# EAGLE design MyRollerShutter_nrf_1-3a (EAGLE 6.5.0)
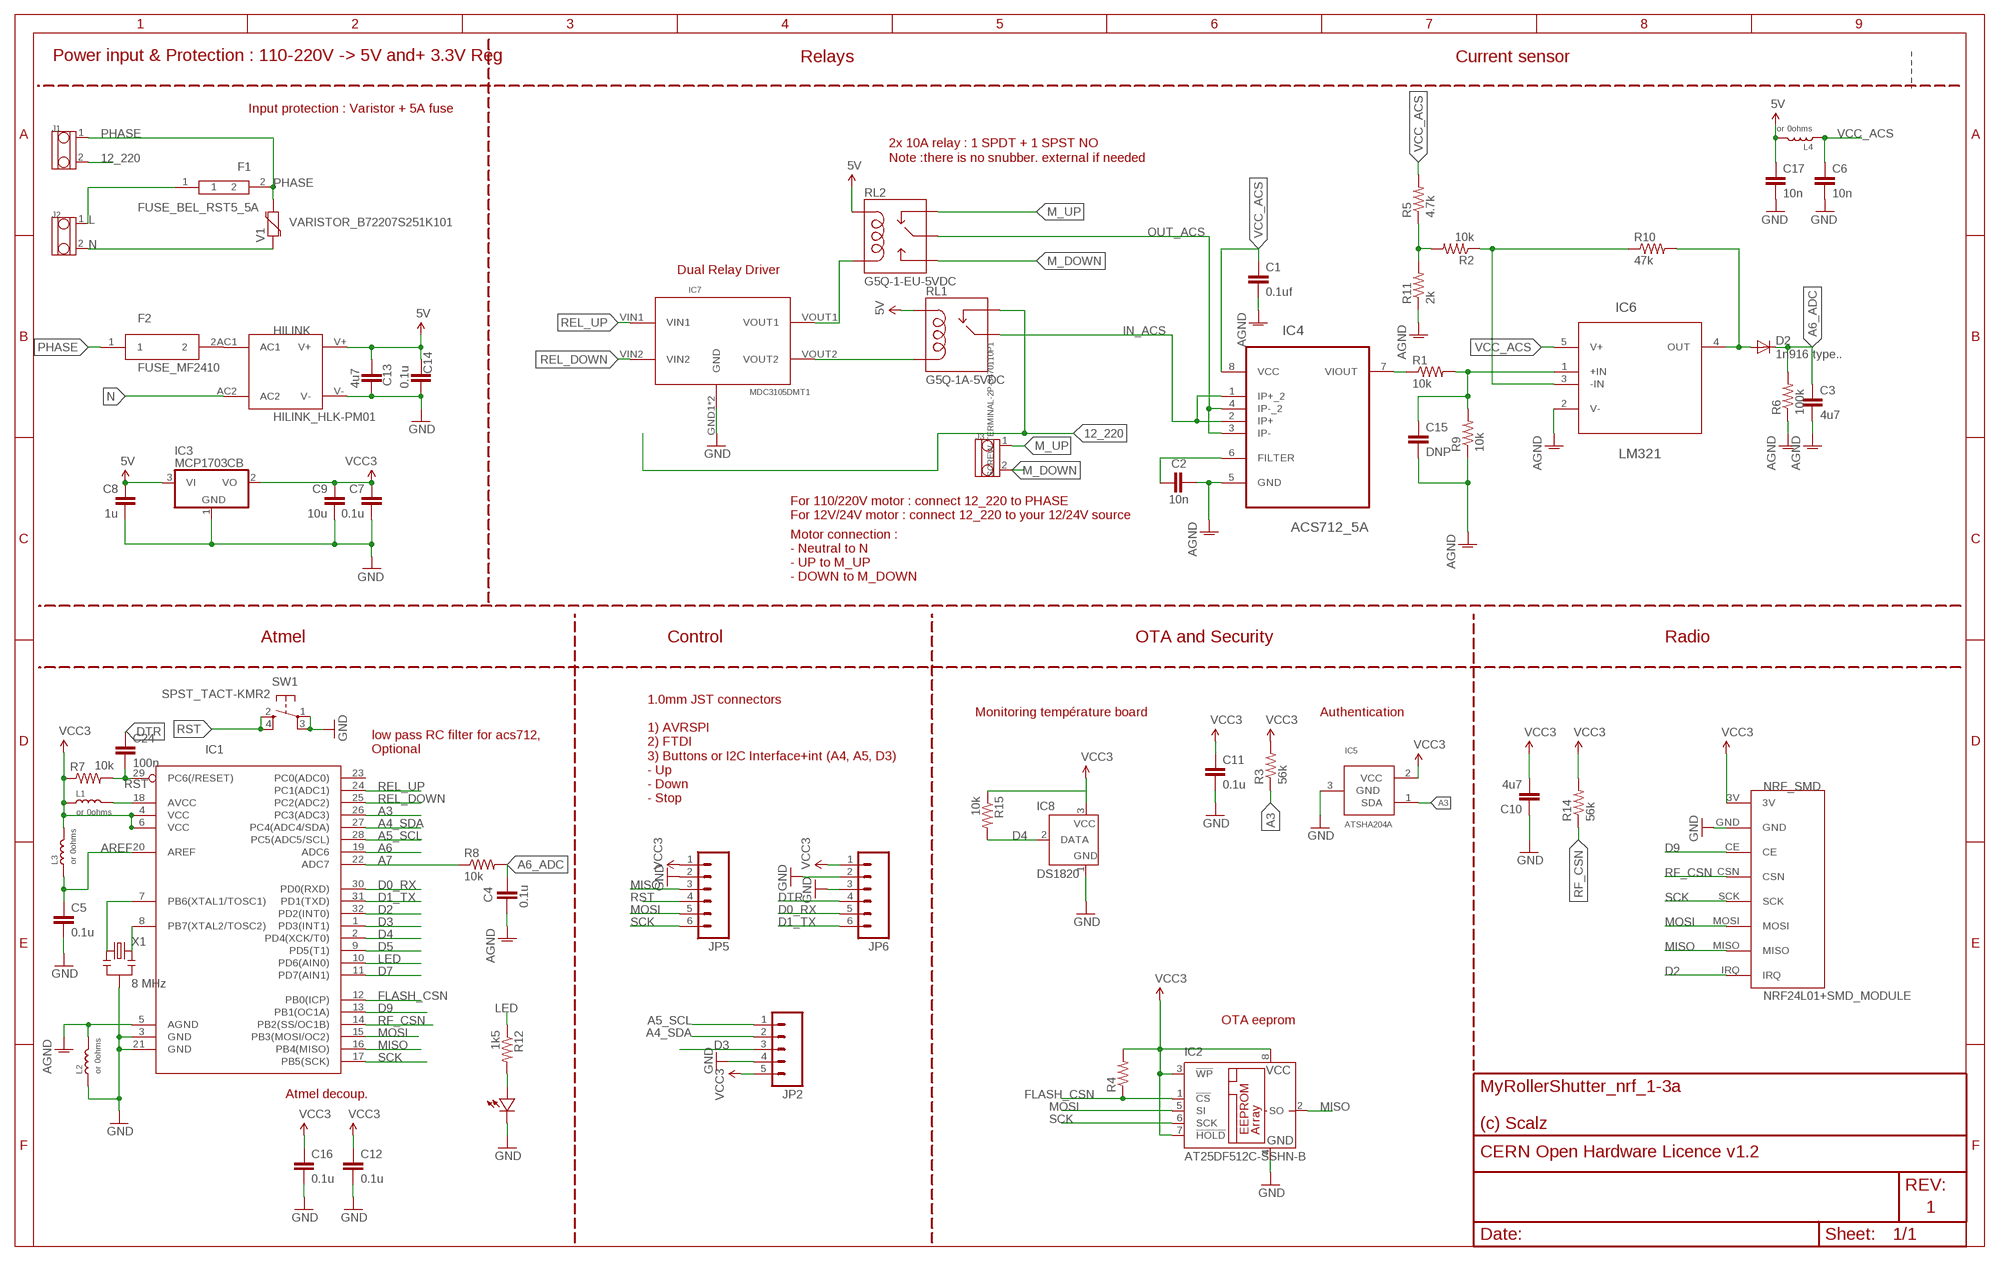
[diagram p0: schematic, sheet 1]

## Parts
C1  0.1uf  CAP0805-CAP  [0805-CAP]
C2  10n  CAP0805-CAP  [0805-CAP]
C3  4u7  CAP0805-CAP  [0805-CAP]
C4  0.1u  CAP0805-CAP  [0805-CAP]
C5  0.1u  CAP0805-CAP  [0805-CAP]
C6  10n  CAP0805-CAP  [0805-CAP]
C7  0.1u  CAP0805-CAP  [0805-CAP]
C8  1u  CAP0805-CAP  [0805-CAP]
C9  10u  CAP0805-CAP  [0805-CAP]
C10  4u7  CAP0805-CAP  [0805-CAP]
C11  0.1u  CAP0805-CAP  [0805-CAP]
C12  0.1u  CAP0805-CAP  [0805-CAP]
C13  4u7  CAP0805-CAP  [0805-CAP]
C14  0.1u  CAP0805-CAP  [0805-CAP]
C15  DNP  CAP0805-CAP  [0805-CAP]
C16  0.1u  CAP0805-CAP  [0805-CAP]
C17  10n  CAP0805-CAP  [0805-CAP]
C24  100n  CAP0805-CAP  [0805-CAP]
D1  LED0805  [0805-LED]
D2  1n916 type..  DIODESOD  [SOD-323]
F1  FUSE_BEL_RST5_5A  [FUSE_BEL_RST5_5A]
F2  FUSE_MF2410  [2410]
HILINK  HILINK_HLK-PM01  [HILINK_HLK-PM01]
IC1  ATMega-328  ATMEGA168/328TQFP32  [TQFP32-08]
IC2  AT25DF512C-SSHN-B  25AA080SN  [SO-08]
IC3  MCP1703CB  [SOT23]
IC4  ACS712_5A  ACS712ELCTR-20A-T  [SOIC127P600X175-8N]
IC5  ATSHA204A  [SOT23]
IC6  LM321  LM321MF  [SOT95P285X120-5N]
IC7  MDC3105DMT1  [MDC3105DMT1]
IC8  DS1820  [TO92-]
J1  SCREW-TERMINAL-2P-3470110P1  [2P-5.0]
J2  SCREW-TERMINAL-2P-3470110P1  [2P-5.0]
J3  SCREW-TERMINAL-2P-3470110P1  [2P-5.0]
JP2  M05SMD  [1X05-1MM]
JP5  M06SMD-1MM  [1X06-1MM]
JP6  M06SMD-1MM  [1X06-1MM]
L1  or 0ohms  INDUCTOR/FERRITE-BEAD-0805  [L0805]
L2  or 0ohms  INDUCTOR/FERRITE-BEAD-0805  [L0805]
L3  or 0ohms  INDUCTOR/FERRITE-BEAD-0805  [L0805]
L4  or 0ohms  INDUCTOR/FERRITE-BEAD-0805  [L0805]
NRF_SMD  NRF24L01+SMD_MODULE  [NRF24L01+SMD_MODULE]
R1  10k  RESISTOR0805-RES  [0805-RES]
R2  10k  RESISTOR0805-RES  [0805-RES]
R3  56k  RESISTOR0805-RES  [0805-RES]
R4  RESISTOR0805-RES  [0805-RES]
R5  4.7k  RESISTOR0805-RES  [0805-RES]
R6  100k  RESISTOR0805-RES  [0805-RES]
R7  10k  RESISTOR0805-RES  [0805-RES]
R8  10k  RESISTOR0805-RES  [0805-RES]
R9  10k  RESISTOR0805-RES  [0805-RES]
R10  47k  RESISTOR0805-RES  [0805-RES]
R11  2k  RESISTOR0805-RES  [0805-RES]
R12  1k5  RESISTOR0805-RES  [0805-RES]
R14  56k  RESISTOR0805-RES  [0805-RES]
R15  10k  RESISTOR0805-RES  [0805-RES]
RL1  G5Q-1A-5VDC  G5Q_SINGLE  [G5Q_SINGLE]
RL2  G5Q-1-EU-5VDC  RELAYPTH  [RELAY-G5Q]
SW1  SPST_TACT-KMR2  [KMR2]
V1  VARISTOR_B72207S251K101  [VARISTOR_B72207S251K101]
X1  8 MHz  RESONATORSMD  [RESONATOR-SMD]

## Nets
5V: C8.1 C13.1 C14.1 C17.1 HILINK.V+ IC3.3(VI) L4.2 RL1.1(COIL1) RL2.5(COIL1)
12_220: J1.2 RL1.3(NC)
A3: IC1.26(PC3(ADC3)) IC5.1(SDA) R3.1
A4_SDA: IC1.27(PC4(ADC4/SDA)) JP2.2
A5_SCL: IC1.28(PC5(ADC5/SCL)) JP2.1
A6: IC1.19(ADC6)
A6_ADC: C3.1 C4.2 D2.1(C) R6.2 R8.2
A7: IC1.22(ADC7) R8.1
AGND: C1.2 C2.2 C3.2 C4.1 C15.2 IC1.5(AGND) IC4.5(GND) IC6.2(V-) L2.2 R6.1 R9.1 R11.1
AREF: C5.1 IC1.20(AREF) L3.1
D0_RX: IC1.30(PD0(RXD)) JP6.5
D1_TX: IC1.31(PD1(TXD)) JP6.6
D2: IC1.32(PD2(INT0)) NRF_SMD.IRQ
D3: IC1.1(PD3(INT1)) JP2.3
D4: IC1.2(PD4(XCK/T0)) IC8.2(DATA) R15.2
D5: IC1.9(PD5(T1))
D7: IC1.11(PD7(AIN1))
D9: IC1.13(PB1(OC1A)) NRF_SMD.CE
DTR: C24.1 JP6.4
FLASH_CSN: IC1.12(PB0(ICP)) IC2.1(!CS) R4.1
GND: C5.2 C6.2 C7.2 C8.2 C9.2 C10.1 C11.2 C12.2 C13.2 C14.2 C16.2 C17.2 D1.MINUS HILINK.V- IC1.3(GND) IC1.21(GND) IC2.4(GND) IC3.1(GND) IC5.3(GND) IC7.GND1(GND) IC7.GND2(GND) IC8.1(GND) JP2.4 JP5.2 JP6.2 JP6.3 L2.1 NRF_SMD.GND SW1.1(P) SW1.3(P1) X1.2
IN_ACS: IC4.1(IP+_2) IC4.2(IP+) RL1.2(MAIN)
L: F1.1 J2.1
LED: IC1.10(PD6(AIN0)) R12.1
LM_OUT: D2.2(A) IC6.4(OUT) R10.2
M_DOWN: J3.2 RL2.3(NO)
M_UP: J3.1 RL2.4(NC)
MISO: IC1.16(PB4(MISO)) IC2.2(SO) JP5.3 NRF_SMD.MISO
MOSI: IC1.15(PB3(MOSI/OC2)) IC2.5(SI) JP5.5 NRF_SMD.MOSI
N: HILINK.AC2 J2.2 V1.1
N$1: C2.1 IC4.6(FILTER)
N$3: IC4.7(VIOUT) R1.1
N$4: IC1.18(AVCC) L1.2
N$6: IC7.VOUT2 RL1.5(COIL2)
N$9: F2.2 HILINK.AC1
N$10: C15.1 IC6.1(+IN) R1.2 R9.2
N$11: IC6.3(-IN) R2.1 R10.1
N$12: IC1.7(PB6(XTAL1/TOSC1)) X1.1
N$17: D1.PLUS R12.2
N$18: R2.2 R5.1 R11.2
N$19: IC7.VOUT1 RL2.1(COIL2)
N$21: IC1.8(PB7(XTAL2/TOSC2)) X1.3
OUT_ACS: IC4.3(IP-) IC4.4(IP-_2) RL2.2(MAIN)
PHASE: F1.2 F2.1 J1.1 V1.2
REL_DOWN: IC1.25(PC2(ADC2)) IC7.VIN2
REL_UP: IC1.24(PC1(ADC1)) IC7.VIN1
RF_CSN: IC1.14(PB2(SS/OC1B)) NRF_SMD.CSN R14.1
RST: C24.2 IC1.29(PC6(/RESET)) JP5.4 R7.2 SW1.2(S) SW1.4(S1)
SCK: IC1.17(PB5(SCK)) IC2.6(SCK) JP5.6 NRF_SMD.SCK
VCC: C7.1 C9.1 C10.2 C11.1 C12.1 C16.1 IC1.4(VCC) IC1.6(VCC) IC2.3(!WP) IC2.7(!HOLD) IC2.8(VCC) IC3.2(VO) IC5.2(VCC) IC8.3(VCC) JP2.5 JP5.1 JP6.1 L1.1 L3.2 NRF_SMD.3V R3.2 R4.2 R7.1 R14.2 R15.1 ; supply symbol labelled VCC3
VCC_ACS: C1.1 C6.1 IC4.8(VCC) IC6.5(V+) L4.1 R5.2
Unconnected: IC1.23(PC0(ADC0))

## Notes on the sheet
- Power input & Protection : 110-220V -> 5V and+ 3.3V Reg | Relays | Current sensor
- Input protection : Varistor + 5A fuse
- 2x 10A relay : 1 SPDT + 1 SPST NO
- Note :there is no snubber. external if needed
- Dual Relay Driver
- For 110/220V motor : connect 12_220 to PHASE
  For 12V/24V motor : connect 12_220 to your 12/24V source
- Motor connection : 
  - Neutral to N
  - UP to M_UP
  - DOWN to M_DOWN
- Atmel | Control | OTA and Security | Radio
- Monitoring température board | Authentication
- low pass RC filter for acs712, 
  Optional
- 1.0mm JST connectors
  
  1) AVRSPI
  2) FTDI
  3) Buttons or I2C Interface+int (A4, A5, D3)
  - Up
  - Down
  - Stop
- OTA eeprom
- Atmel decoup.

## Library data of the parts
C1-C17 C24 = LowPowerLab:CAP: Capacitor Standard 0603 ceramic capacitor, and 0.1" leaded capacitor.
D1 = LowPowerLab:LED
D2 = SparkFun-DiscreteSemi:DIODE: Diode These are standard reverse protection diodes and small signal diodes. SMA package can handle up to about 1A. SOD-323 can handle about 200mA. What the SOD-323 package when ordering, there are some mfgs out there that are 5-pin packages.; PROD_ID: DIO-09646
F1 = rollershutter:FUSE_BEL_RST5_5A
F2 = rollershutter:FUSE_MF2410
HILINK = rollershutter:HILINK_HLK-PM01
IC1 = LowPowerLab:ATMEGA168/328: Atmel 32-pin 8-bit micro, 16k flash.; EAGLEUP: TQFP32-08
IC2 = microchip:25*: Serial EEPROM 4K/ 8K , SPI bus; MF: MICROCHIP; MPN: 25AA080/SN; OC_FARNELL: 1816072; OC_NEWARK: 92C7351
IC3 = linear:MCP1703: 250 mA, 16V, Low Quiescent Current LDO Regulator Source: http://ww1.microchip.com/downloads/en/DeviceDoc/22049b.pdf
IC4 = rollershutter:ACS712ELCTR-20A-T: Linear Current Sensor; MPN: ACS712ELCTR-20A-T; OC_FARNELL: 1329624; OC_NEWARK: 31M3133; PACKAGE: SOIC-8; SUPPLIER: Allegro
IC5 = rollershutter:ATSHA204A
IC6 = rollershutter:LM321MF: Low Power Single Op Amp; MPN: LM321MF; OC_FARNELL: 9779116; OC_NEWARK: 37K8530; PACKAGE: SOT-23-5; SUPPLIER: National Semiconductors
IC7 = rollershutter:MDC3105DMT1
IC8 = rollershutter:DS1820
J1-J3 = Connector:SCREW-TERMINAL-2P
JP2 = SparkFun-Connectors:M05: Header 5 Standard 5-pin 0.1" header. Use with straight break away headers (SKU : PRT-00116), right angle break away headers (PRT-00553), swiss pins (PRT-00743), machine pins (PRT-00117), and female headers (PRT-00115). Molex polarized connector foot print use with SKU : PRT-08230 with associated crimp pins and housings.
JP5 JP6 = SparkFun-Connectors:M06: Header 6 Standard 6-pin 0.1" header. Use with straight break away headers (SKU : PRT-00116), right angle break away headers (PRT-00553), swiss pins (PRT-00743), machine pins (PRT-00117), and female headers (PRT-00115). Molex polarized connector foot print use with SKU : PRT-08094 with associated crimp pins and housings. NOTES ON THE VARIANTS LOCK and LOCK_LONGPADS... This footprint was designed to help hold the alignment of a through-hole component (i.e. 6-pin header) while soldering it into place. You may notice that each hole has been shifted either up or down by 0.005 of an inch from it's more standard position (which is a perfectly straight line). This slight alteration caused the pins (the squares in the middle) to touch the edges of the holes. Because they are alternating, it causes a "brace" to hold the component in place. 0.005 has proven to be the perfect amount of "off-center" position when using our standard breakaway headers. Although looks a little odd when you look at the bare footprint, once you have a header in there, the alteration is very hard to notice. Also,if you push a header all the way into place, it is covered up entirely on the bottom side. This idea of altering the position of holes to aid alignment will be further integrated into the Sparkfun Library for other footprints. It can help hold any component with 3 or more connection pins.
L1-L4 = Discrete:INDUCTOR/FERRITE-BEAD
NRF_SMD = rollershutter:NRF24L01+SMD_MODULE
R1-R12 R14 R15 = LowPowerLab:RESISTOR: Resistor Basic schematic elements and footprints for 0603, 1206, and PTH resistors.
RL1 = rollershutter:G5Q_SINGLE
RL2 = rollershutter:RELAY: SPDT relay (COM-00101)
SW1 = adafruit:SPST_TACT: SMT 6mm switch, EVQQ2 series http://www.ladyada.net/library/eagle
V1 = rollershutter:VARISTOR_B72207S251K101
X1 = SparkFun:RESONATOR: Resonator Small SMD resonator. This is the itty bitty 10/20MHz resonators with built in caps. CSTCE10M0G55 and CSTCE20M0V53. Footprint has been reviewed closely but hasn't been tested yet.

## Net classes
1 Power: width 0.406 mm

## Board
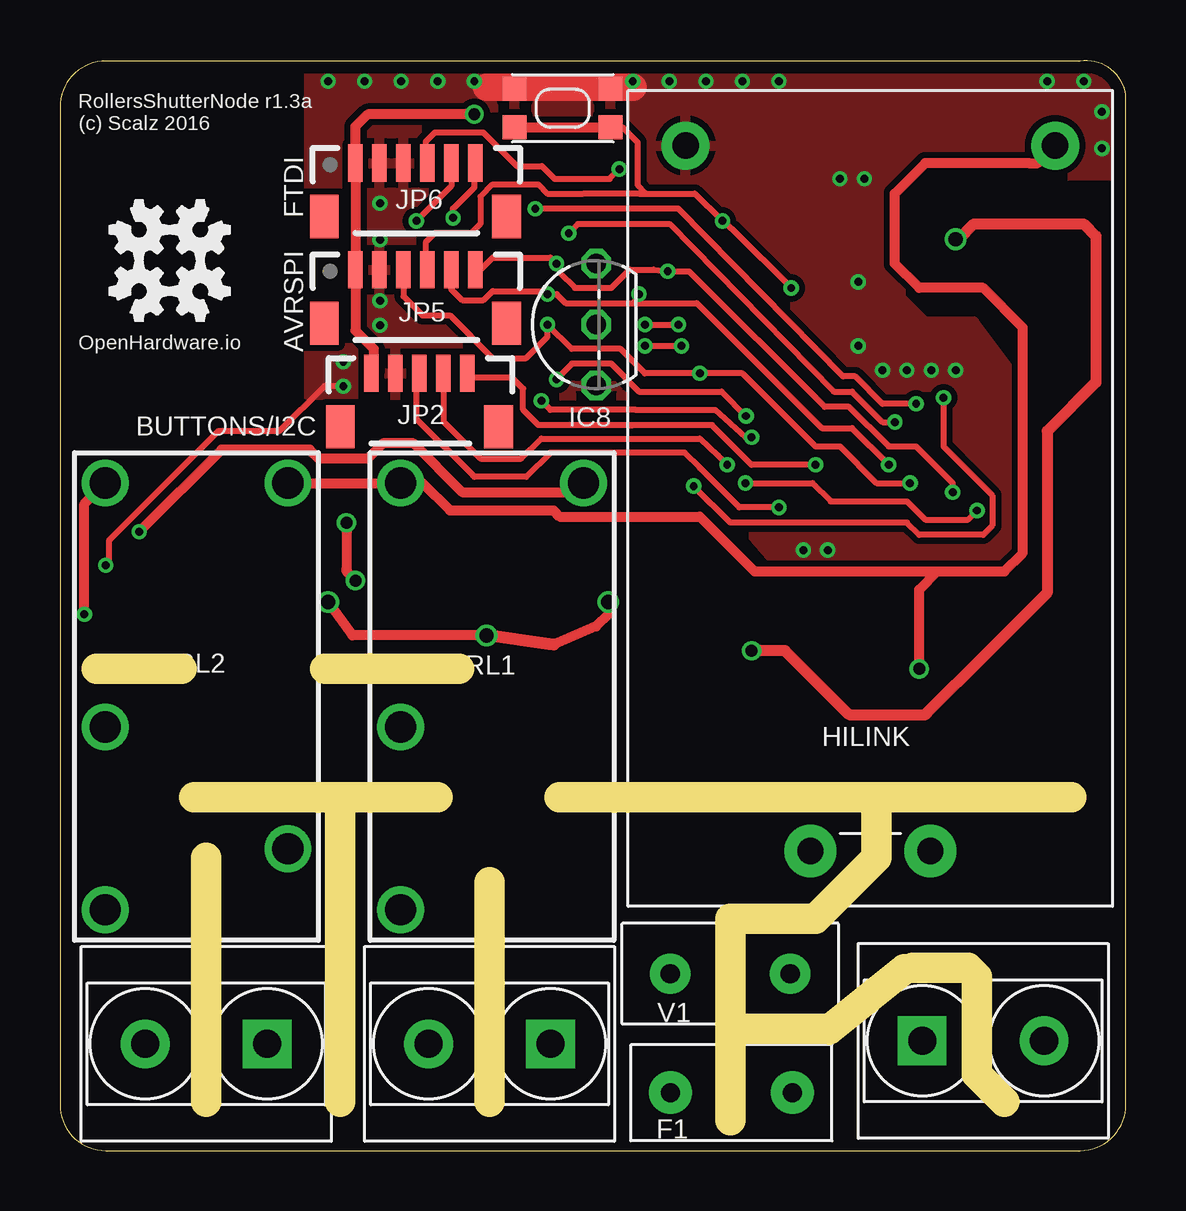
[diagram p1: board, top side]
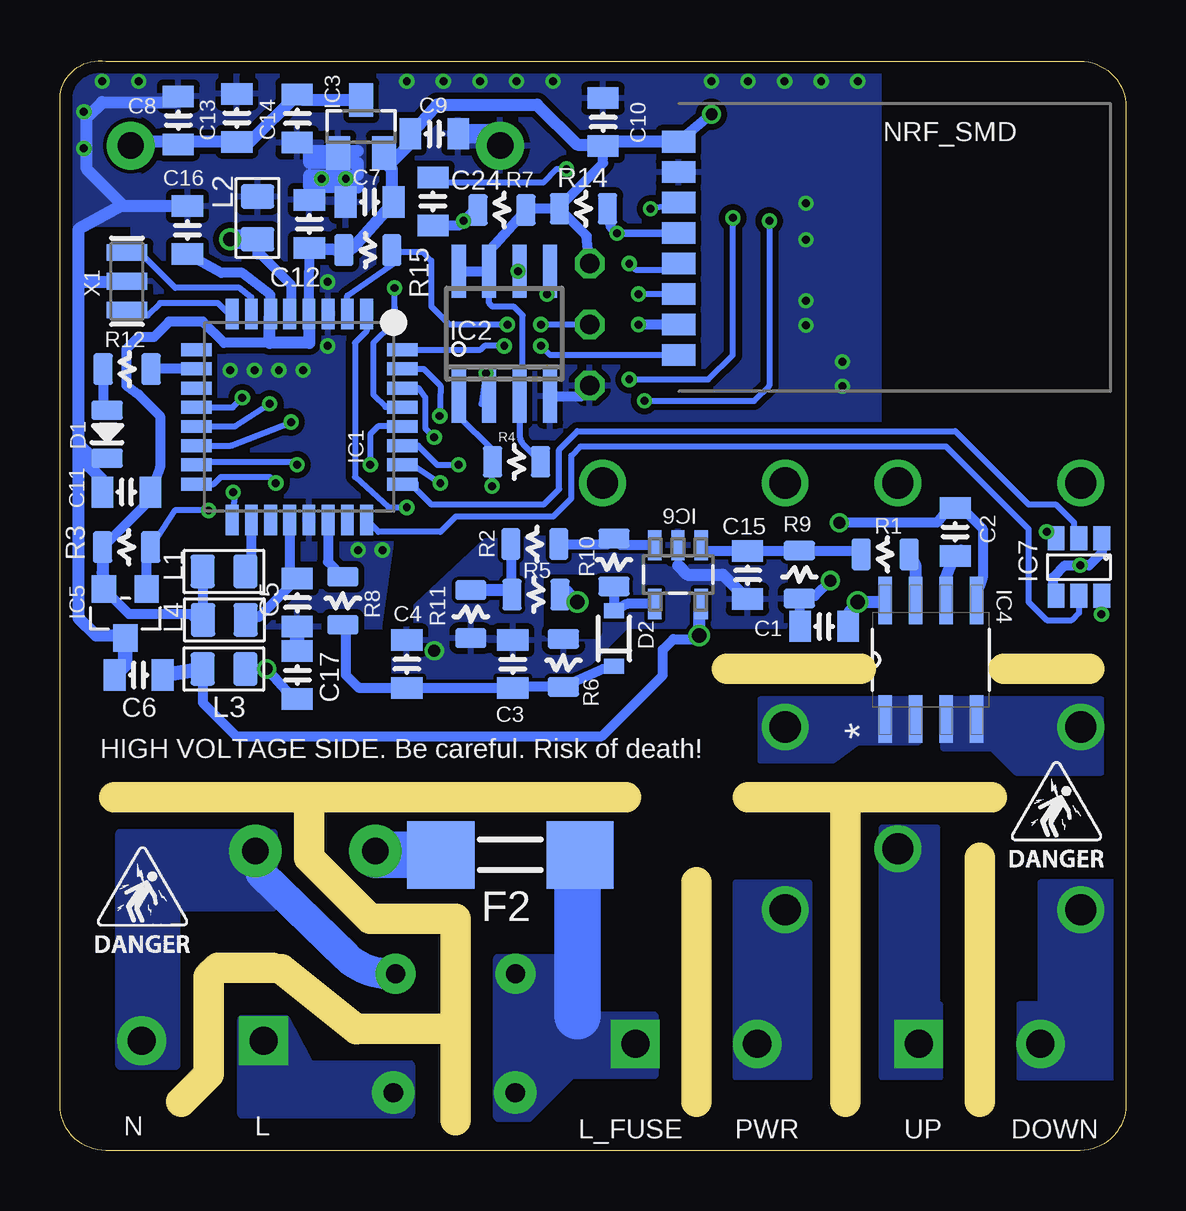
[diagram p2: board, bottom side, seen from below]

Size 44.43 x 45.41 mm. Coordinates in mm from the lower left corner, seen from the top.
Outline: 44.43,1.91 44.43,43.99 arc90 42.52,45.39 1.91,45.39 arc90 0,43.48 0,1.91 arc90 1.91,0 42.52,0 arc90 44.43,1.91
Copper layers (1*16): Top 0.035mm / dielectric 1.6mm / Bottom 0.035mm
Design rules "Elecrow_2-layer_PCB_eagle_rule": minimum track width 6mil, minimum drill 12mil, track to track 6mil, track to pad 6mil, pad to pad 6mil, via to via 8mil, smd to smd 0mil, copper to edge 20mil, drill to drill 10mil, minimum pad ring 6mil, minimum via ring 6mil, stop-mask expansion 0mil, vias tented up to drill 100mil, thermal gap 10mil
Milling: 19 lines

### Footprints (pad centres in the part's own frame; a part is rotated, then mirrored left to right if it is on the bottom)
0805-CAP = smd 0.902 x 1.3: 1 -1,0; 2 1,0
0805-LED = smd 0.8 x 1.3: MINUS -1,0; PLUS 1,0
SOD-323 = smd 0.63 x 0.83: 1 -1.15,0; 2 1.15,0
FUSE_BEL_RST5_5A = drill 0.8 pad 1.778: 1 -2.54,0; 2 2.54,0
2410 = smd 2.8 x 2.8: 1 -2.9,0; 2 2.9,0
HILINK_HLK-PM01 = drill 1.1 pad 2.184: AC1 2.5,14.7; AC2 -2.5,14.7 | drill 1.1 pad 2: V+ -7.7,-14.7; V- 7.7,-14.7
TQFP32-08 = smd 1.27 x 0.533: 1 -4.293,2.8; 2 -4.293,2; 3 -4.293,1.2; 4 -4.293,0.4; 5 -4.293,-0.4; 6 -4.293,-1.2; 7 -4.293,-2; 8 -4.293,-2.8; 17 4.293,-2.8; 18 4.293,-2; 19 4.293,-1.2; 20 4.293,-0.4; 21 4.293,0.4; 22 4.293,1.2; 23 4.293,2; 24 4.293,2.8 | smd 0.533 x 1.27: 9 -2.8,-4.293; 10 -2,-4.293; 11 -1.2,-4.293; 12 -0.4,-4.293; 13 0.4,-4.293; 14 1.2,-4.293; 15 2,-4.293; 16 2.8,-4.293; 25 2.8,4.293; 26 2,4.293; 27 1.2,4.293; 28 0.4,4.293; 29 -0.4,4.293; 30 -1.2,4.293; 31 -2,4.293; 32 -2.8,4.293
SO-08 = smd 0.6 x 2.2: 1 -1.905,-2.6; 2 -0.635,-2.6; 3 0.635,-2.6; 4 1.905,-2.6; 5 1.905,2.6; 6 0.635,2.6; 7 -0.635,2.6; 8 -1.905,2.6
SOT23 = smd 1 x 1.4: 1 -0.95,-1.1; 2 0.95,-1.1; 3 0,1.1
SOIC127P600X175-8N = smd 1.981 x 0.559: 1 -2.464,1.905; 2 -2.464,0.635; 3 -2.464,-0.635; 4 -2.464,-1.905; 5 2.464,-1.905; 6 2.464,-0.635; 7 2.464,0.635; 8 2.464,1.905
SOT23' = smd 1.016 x 1.143: 1 -0.889,-1.016; 2 0.889,-1.016; 3 0,1.016
SOT95P285X120-5N = smd 1.27 x 0.559: 1 -1.219,0.965; 2 -1.219,0; 3 -1.219,-0.965; 4 1.219,-0.965; 5 1.219,0.965
MDC3105DMT1 = smd 0.7 x 1: GND1 -0.95,-1.2; GND2 0.95,1.2; VIN1 0,1.2; VIN2 0,-1.2; VOUT1 -0.95,1.2; VOUT2 0.95,-1.2
TO92- = drill 0.813 octagon: 1 -2.54,0; 2 0,0; 3 2.54,0
2P-5.0 = drill 1.168 pad 2.032 square: 1 -2.54,0 | drill 1.168 pad 2.032: 2 2.54,0
1X05-1MM = smd 0.6 x 1.55: 1 -2,0; 2 -1,0; 3 0,0; 4 1,0; 5 2,0 | smd 1.2 x 1.8: NC1 -3.3,2.225; NC2 3.3,2.225
1X06-1MM = smd 0.6 x 1.55: 1 -2.54,1.27; 2 -1.54,1.27; 3 -0.54,1.27; 4 0.46,1.27; 5 1.46,1.27; 6 2.46,1.27 | smd 1.2 x 1.8: P$1 -3.84,-0.955; P$2 3.76,-0.955
L0805 = smd 1.016 x 1.397: 1 -0.889,0; 2 0.889,0
NRF24L01+SMD_MODULE = smd 0.9 x 1.4: 3V -4.8,-9.6; CE -2.26,-9.6; CSN -0.99,-9.6; GND -3.53,-9.6; IRQ 4.09,-9.6; MISO 2.82,-9.6; MOSI 1.55,-9.6; SCK 0.28,-9.6
0805-RES = smd 0.8 x 1.3: 1 -1,0; 2 1,0
G5Q_SINGLE = drill 1.3: 1 10.16,3.81; 2 0,3.81; 3 -7.62,3.81; 5 10.16,-3.81
RELAY-G5Q = drill 1.3: 1 8.89,3.81; 2 -1.27,3.81; 3 -8.89,3.81; 4 -6.35,-3.81; 5 8.89,-3.81
KMR2 = smd 1 x 1: 1 2,0.8; 2 2,-0.8; 3 -2,0.8; 4 -2,-0.8
VARISTOR_B72207S251K101 = drill 0.8 pad 1.676: 1 -2.5,0; 2 2.5,0
RESONATOR-SMD = smd 0.7 x 1.7: 1 -1.2,0; 2 0,0; 3 1.2,0

### Placement (x,y rotation side)
C1  12.57,21.84 180 bottom
C2  7.11,25.78 90 bottom
C3  25.55,20.27 90 bottom
C4  29.97,20.27 270 bottom
C5  34.54,22.83 270 bottom
C6  41.15,19.81 180 bottom
C7  31.52,39.52 180 bottom
C8  39.5,42.93 90 bottom
C9  28.83,42.37 0 bottom
C10  21.79,42.85 270 bottom
C11  41.66,27.43 180 bottom
C12  34.04,38.61 90 bottom
C13  37.06,43.03 90 bottom
C14  34.54,43 270 bottom
C15  15.77,23.98 270 bottom
C16  39.12,38.35 90 bottom
C17  34.54,19.81 90 bottom
C24  28.88,39.55 270 bottom
D1  42.47,29.84 90 bottom
D2  21.34,21.34 90 bottom
F1  27.99,2.41 180 top
F2  25.65,12.32 180 bottom
HILINK  33.78,27.18 180 top
IC1  34.45,30.57 270 bottom
IC2  25.91,34.04 0 bottom
IC3  31.88,42.67 0 bottom
IC4  8.13,20.45 90 bottom
IC5  ATSHA204A  [SOT23']  41.71,22.38 180 bottom
IC6  18.67,24 270 bottom
IC7  1.96,24.31 180 bottom
IC8  22.35,34.42 90 top
J1  17.91,4.45 180 top
J2  38.48,4.57 0 top
J3  6.1,4.45 180 top
JP2  14.99,32.38 180 top
JP5  14.86,35.43 0 top
JP6  14.86,39.88 0 top
L1  37.59,24.13 0 bottom
L2  36.2,38.86 270 bottom
L3  37.58,22.11 180 bottom
L4  37.59,20.07 0 bottom
NRF_SMD  9.04,37.24 270 bottom
R1  10.03,24.84 180 bottom
R2  24.64,25.27 180 bottom
R3  41.66,25.15 180 bottom
R4  25.4,28.7 0 bottom
R5  24.59,23.16 0 bottom
R6  23.44,20.32 270 bottom
R7  26.01,39.19 180 bottom
R8  32.64,22.91 270 bottom
R9  13.61,24 90 bottom
R10  21.34,24.51 270 bottom
R11  27.3,22.35 90 bottom
R12  41.63,32.56 180 bottom
R14  22.61,39.24 180 bottom
R15  31.6,37.52 0 bottom
RL1  18.01,17.65 90 top
RL2  5.69,18.92 90 top
SW1  20.95,43.43 0 top
U$2  [ELECTROCUTION_SMALL]  5.08,11.68 0 bottom
U$3  [ELECTROCUTION_SMALL]  43.18,8.13 0 bottom
U$5  [OPENHW_IO_SMALL]  2.03,34.54 0 top
V1  27.94,7.37 180 top
X1  41.63,36.22 270 bottom

### Tracks (layer width: path | path; a pad name or v marks a point on that pad's centre or on a via)
5V  (via drill 0.5)
  Top 0.406: RL2.5 RL1.1 15.11,27.81 16.26,26.67 20.57,26.67 20.83,26.42 26.67,26.42 28.96,24.13 36.58,24.13 | 36.58,24.13 39.37,24.13 40.13,24.89 40.13,34.29 38.48,35.94 35.81,35.94 34.8,36.96 34.8,39.88 36.07,41.15 40.39,41.15 40.75,41.15 HILINK.V+ | v35.81,20.07 35.81,23.37 36.58,24.13
  Bottom 0.406: 34.31,43.77 C14.1 | C17.1 34.69,18.81 v35.81,20.07 L4.2
  Bottom 0.508: C13.1 36.52,42.03 | 36.52,42.03 C14.1 | IC3.3 34.31,43.77 | 39.34,42.03 C8.1 39.34,42.03 | 39.34,42.03 41.33,42.03 HILINK.V+ | 36.52,42.03 39.34,42.03
12_220
  pour Bottom (no thermals): 13.21,11.18 13.21,3.05 16.26,3.05 16.26,11.18
A3  (via drill 0.33 pad 0.64)
  Top 0.254: v28.57,27.81 31.37,27.81 32.13,27.05 35.31,27.05 36.07,26.29 37.85,26.29 v38.23,26.67
  Bottom 0.254: IC1.26 29.72,28.57 v28.57,27.81 | v38.23,26.67 39.64,26.67 R3.1
  Bottom 0.406: IC5.1 40.82,24.98 R3.1
A4_SDA  (via drill 0.33 pad 0.64)
  Top 0.254: JP2.2 16,32.37 16,30.35 17.53,28.83 19.23,28.83 20.07,29.67 26.67,29.67 27.43,28.96 v27.81,28.57
  Bottom 0.254: IC1.27 29.5,29.37 28.7,28.57 v27.81,28.57
A5_SCL  (via drill 0.33 pad 0.64)
  Top 0.254: 23.75,30.23 27.18,30.23 28.83,28.57 v31.5,28.57 | JP2.1 17.14,32.23 18.83,32.23 19.3,31.75 19.3,30.86 19.94,30.23 23.75,30.23 | 23.75,30.23 23.88,30.23 23.75,30.23
  Bottom 0.254: IC1.28 31.17,30.17 31.5,29.84 v31.5,28.57
A6_ADC
  Bottom 0.406: D2.1 21.8,20.06 R6.2 25.5,19.32 C3.1 C4.2 31.86,19.27 arc45 32.04,19.34 32.51,19.81 32.51,21.68 arc-45 32.59,21.86 R8.2 32.51,21.78
A7
  Bottom 0.406: IC1.22 33.25,24.53 R8.1
AGND  (via drill 0.5, 0.6)
  Top 0.406: v11.94,26.16 11.94,24.23 arc45 12.01,24.06 v12.32,23.75 | 36.09,18.16 arc45 36.14,18.23 | v37.34,37.97 37.47,37.97
  Top 0.457: 36.09,18.16 32.89,18.16 30.23,20.83 v28.83,20.83 | 36.14,18.23 38.61,20.7 41.15,23.24 41.15,29.97 43.18,32 43.18,38.1 42.67,38.61 38.1,38.61 37.47,37.97
  Bottom 0.406: IC1.5 34.8,34.92 34.8,36.07 36.07,37.34 36.2,37.34 L2.2 | 6.17,22.91 6.17,23.29 6.1,23.5 5.97,23.88 5.97,25.91 6.84,26.78 C2.2 7.38,26.78 7.87,26.16 v11.94,26.16 | C1.2 arc45 13.61,21.94 R9.1 13.58,23.04 arc45 13.4,23.11 12.95,23.11 v12.32,23.75
  Bottom 0.508: 18.67,24.38 18.29,24 16.8,24 C15.2 | IC4.5 6.17,22.91
  Bottom 0.813: L2.2 v37.34,37.97
  pour Bottom: 14.22,26.04 14.22,21.84 20.83,21.84 23.37,19.3 30.48,19.3 30.48,21.84 26.67,25.4
AREF
  Bottom 0.406: IC1.20 34.85,24.14 C5.1 36.13,22.24 L3.1
D0_RX  (via drill 0.33 pad 0.64)
  Top 0.254: v28.83,29.72 28.57,29.72 27.3,30.86 24,30.86 20.45,30.86 v20.07,31.24 | JP6.5 16.32,40.2 v14.86,38.73
  Bottom 0.254: IC1.30 29.48,31.77 29.21,31.37 29.21,30.1 v28.83,29.72 | v20.07,31.24 15.49,31.24 14.86,31.88 v14.86,38.73
D1_TX  (via drill 0.33 pad 0.64)
  Top 0.254: v16.38,38.86 16.38,39.24 17.27,40.13 17.27,41.1 JP6.6 | v20.7,32.13 21.34,32.79 22.99,32.79 24.13,31.62 27.58,31.62 v28.6,30.61
  Bottom 0.254: IC1.31 29.27,32.57 28.57,31.88 v28.6,30.61 | v20.7,32.13 17.4,32.13 16.38,33.15 v16.38,38.86
D2  (via drill 0.33 pad 0.64)
  Top 0.254: v24.38,33.53 v25.91,33.53
  Bottom 0.254: IC1.32 26.89,33.37 26.73,33.53 v25.91,33.53 | NRF_SMD.IRQ 24,33.15 v24.38,33.53
D3  (via drill 0.33 pad 0.64)
  Top 0.254: JP2.3 14.86,32.26 14.86,30.48 17.21,28.13 17.27,28.07 19.43,28.07 20.45,29.08 26.04,29.08 26.67,28.45 28.32,26.8 v29.97,26.8
  Bottom 0.254: IC1.1 31.65,34.13 32.13,33.66 32.13,28.07 30.73,26.8 v29.97,26.8
D4  (via drill 0.33 pad 0.64)
  Top 0.254: v24.38,34.42 v25.78,34.42
  Bottom 0.254: IC1.2 32.45,35.62 30.35,37.08 30.35,37.48 R15.2 30.23,37.45 29.32,37.45 28.96,37.08 28.96,35.18 28.19,34.42 v25.78,34.42 | IC8.2 v24.38,34.42
D9  (via drill 0.33 pad 0.64)
  Top 0.254: v19.81,39.24 25.78,39.24 32.64,32.26 33.15,32.26 34.29,31.11 v35.69,31.11
  Bottom 0.254: NRF_SMD.CE 19.05,39.37 v19.81,39.24 | IC1.13 37.14,30.17 v35.69,31.11
DTR  (via drill 0.33)
  Top 0.254: 15.24,41.07 JP6.4 15.24,41.23 15.24,42.04 15.62,42.42 17.65,42.42 19.05,41.02 20.09,41.02 20.62,40.49 22.91,40.49 v23.32,40.89
  Bottom 0.254: v23.32,40.89 23.72,40.89 24.28,40.34 27.89,40.34 28.67,40.34 C24.1
FLASH_CSN  (via drill 0.33 pad 0.64)
  Top 0.254: v36.83,31.37 36.83,29.34 38.86,27.3 38.86,26.04 38.48,25.65 35.81,25.65 35.31,26.16 27.94,26.16 v26.42,27.69
  Bottom 0.254: IC2.1 27.81,30.61 26.4,29.19 R4.1 26.42,28.69 v26.42,27.69 | IC1.12 37.23,30.97 v36.83,31.37
GND  (via drill 0.33 pad 0.64)
  Top 0.254: v11.81,31.85 11.02,31.85 9.14,29.97 6.6,29.97 2.03,25.4 2.03,24.51 v1.91,24.38
  Top 1.143: 17.78,44.3 23.88,44.3
  Bottom 0.406: IC2.4 22.67,31.44 IC8.1 | IC7.GND1 1.01,24.9 1.52,24.38 v1.91,24.38 2.54,24.38 3.05,23.88 3.05,23.25 IC7.GND2
  Bottom 0.508: C16.2 41.77,39.35 | 41.77,39.35 43.31,40.89 43.31,43.05 42.67,43.69 39.62,43.69 39.5,43.81 | 41.77,39.35 41.93,39.35 43.66,38.38 43.66,36.2 | 43.66,36.2 41.79,36.2 X1.2 | 43.66,36.2 43.66,29.44 | 43.66,29.44 43.66,28.93 | 43.66,28.93 43.66,22.2 42.93,21.46 41.73,21.46 IC5.3 | D1.MINUS 43.07,28.84 43.66,29.44 | C11.2 42.66,27.92 43.66,28.93 | 32,40.13 34.04,40.13 34.04,40.64 32,40.64 32,41.15 34.04,41.15 34.04,41.66 32,41.66
  Bottom 0.61: C17.2 C5.2 | IC5.3 41.71,20.25 C6.2
  Bottom 0.813: C9.2 26.57,42.37 HILINK.V-
  other vias: 23.88,44.55 17.27,44.55 15.75,44.55 33.27,33.53 33.27,36.2 25.4,44.55 26.92,44.55 28.45,44.55 29.97,44.55 34.29,32.51 35.31,32.51 32,25.02 30.99,25.02 36.32,32.51 37.34,32.51 14.22,44.55 12.7,44.55 11.18,44.55 13.34,35.41 13.34,34.39 13.34,37.95 13.34,39.47 11.81,32.87 41.15,44.55 42.67,44.55 43.43,43.28 43.43,41.76 32.51,40.49 33.53,40.49
  pour Bottom (isolate 0.254, rank 6): 41.38,45.9 41.38,21.84 -0.51,21.84 -0.51,45.9
  pour Top (isolate 0.254, rank 6): 10.29,47.75 10.29,31.5 20.32,31.5 23.37,28.45 26.42,28.45 29.72,24.64 39.62,24.64 39.62,32.51 38.1,34.54 36.07,34.54 35.05,35.56 35.05,39.62 36.07,40.64 44.7,40.64 44.7,47.75
  pour Bottom: 41.66,45.72 45.21,45.72 45.21,38.61 41.15,38.61 41.15,45.72
IN_ACS
  pour Bottom (no thermals): 8.64,18.8 15.24,18.8 15.24,16.26 12.19,16.26 11.18,17.02 8.64,17.02
L
  pour Bottom (no thermals): 29.84,3.56 29.84,1.52 36.83,1.52 36.83,5.46 35.05,5.46 34.04,3.56
LED
  Bottom 0.406: IC1.10 40.5,32.57 R12.1
LM_OUT
  Bottom 0.406: R10.2 D2.2 20.78,22.78 IC6.4
M_DOWN
  pour Bottom (no thermals): 0.51,11.18 3.56,11.18 3.56,6.1 4.45,6.1 4.45,3.05 0.51,3.05
M_UP
  pour Bottom (no thermals): 7.75,3.05 10.16,3.05 10.16,13.46 7.87,13.46 7.87,6.1 7.75,6.1
MISO  (via drill 0.33 pad 0.64)
  Top 0.254: 20.32,34.16 v20.32,34.42 | JP5.3 14.32,35.59 15.11,34.8 16.26,34.8 18.03,33.02 19.43,33.02 20.32,33.91 v20.32,34.42 | v35.43,27.81 34.04,27.81 32.51,29.34 31.5,29.34 28.45,32.38 v26.67,32.38 24.38,32.38 23.37,33.4 21.34,33.4 v20.32,34.42
  Bottom 0.254: 35.48,27.77 v35.43,27.81 35.69,28.07 37.72,28.07 38.02,27.77 IC1.16 | v26.67,32.38 26.86,31.11 IC2.2
  Bottom 0.406: NRF_SMD.MISO 19.68,34.42 v20.32,34.42
MOSI  (via drill 0.33 pad 0.64)
  Top 0.254: 23.88,35.31 21.08,35.31 20.7,35.69 v20.32,35.69 20.19,35.81 18.03,35.81 17.65,35.43 16.76,35.43 16.32,35.88 JP5.5 | 23.88,35.31 26.54,35.31 31.75,30.1 33.02,30.1 v34.54,28.57 | v24.13,35.69 24.13,35.56 23.88,35.31
  Bottom 0.254: v20.32,35.69 19.56,35.69 NRF_SMD.MOSI 18.52,35.81 | 38.22,28.7 34.67,28.7 v34.54,28.57 | IC2.5 24,35.81 v24.13,35.69
  Bottom 0.305: IC1.15 38.22,28.7
N
  Bottom 1.27: V1.1 30.72,7.37 arc44 32.49,8.08 36.07,11.56
  pour Bottom (no thermals): 41.91,3.56 41.91,13.21 35.56,13.21 35.56,10.16 39.62,10.16 39.62,3.56
N$1
  Bottom 0.508: IC4.6 7.49,23.88 7.11,24.89 6.86,25 C2.1
N$2
  cutout Top: -1.52,46.74 10.16,46.74 10.16,21.84 -1.52,21.84
N$3
  Bottom 0.508: IC4.7 8.76,24.35 R1.1
N$4
  Bottom 0.406: IC1.18 36.45,24.63 L1.2
N$5
  cutout Bottom: -2.54,47.24 10.16,47.24 10.16,21.84 -2.54,21.84
N$6  (via drill 0.33 pad 0.64)
  Top 0.254: v3.3,25.78 3.43,25.78
  Top 0.406: v3.3,25.78 6.73,29.21 10.41,29.21 10.79,28.83 12.83,28.83 13.46,29.46 14.73,29.46 16.76,27.43 21.44,27.43 RL1.5
  Bottom 0.254: IC7.VOUT2 3.03,25.51 v3.3,25.78
N$7
  cutout Bottom: 24,24 22.1,24 arc90 21.84,23.75 21.84,21.59 arc90 22.1,21.34 24,21.34 arc90 24.26,21.59 24.26,23.75 arc90
  cutout Bottom: 30.48,25.4 29.72,25.4 29.72,21.84 30.99,21.84
N$9
  Bottom 1.93: F2.2 31.28,12.32 HILINK.AC1
N$10
  Bottom 0.406: IC6.1 17.46,24.98 C15.1 15.75,25 R9.2 11.3,25 arc45 11.12,24.93 R1.2
N$11
  Bottom 0.406: IC6.3 21.05,25.22 R10.1 21.57,25.27 R2.1
N$12
  Bottom 0.254: IC1.7 36.45,35.56 36.96,35.94 39.62,35.94 41.02,37.34 41.59,37.34 X1.1
N$17
  Bottom 0.406: R12.2 42.63,31.01 D1.PLUS
N$18
  Bottom 0.406: R2.2 25.64,23.34 R5.1
  Bottom 0.508: 25.64,23.34 27.04,23.34 R11.2
N$19  (via drill 0.33 pad 0.64)
  Top 0.406: v1.02,22.35 1.02,26.95 RL2.1
  Bottom 0.254: IC7.VOUT1 1.01,22.36 v1.02,22.35
N$21
  Bottom 0.254: IC1.8 37.4,34.86 37.85,35.31 40.26,35.31 40.77,34.8 41.73,34.8 X1.3
OUT_ACS
  pour Bottom (no thermals): 1.02,16.76 1.02,18.8 7.62,18.8 7.62,16.76 5.59,16.76 4.57,15.75 1.02,15.75
PHASE
  Bottom 1.93: F2.1 22.86,12.32 22.86,5.59
  pour Bottom (no thermals): 19.68,5.59 19.68,3.17 23.11,3.17 24.89,1.4 26.16,1.4 26.16,8 23.62,8 23.24,6.73 22.1,5.59
REL_DOWN
  Bottom 0.254: IC7.VIN2 2.16,25.71 2.16,26.16 2.92,26.92 4.06,26.92 7.11,29.97 22.86,29.97 23.62,29.21 23.62,27.56 24.26,26.92 28.96,26.92 29.59,27.56 29.59,27.81 30.12,27.81 IC1.25
REL_UP
  Bottom 0.254: IC1.24 31.16,25.78 28.57,25.78 27.94,26.42 23.88,26.42 23.11,27.18 23.11,28.96 22.73,29.34 7.49,29.34 4.06,25.91 4.06,22.86 3.3,22.1 2.26,22.1 1.96,22.4 IC7.VIN1
RF_CSN  (via drill 0.33 pad 0.64)
  Top 0.254: v21.21,38.23 21.59,38.61 25.4,38.61 32.26,31.62 33.02,31.62 34.29,30.35 v34.8,30.35
  Bottom 0.254: IC1.14 37.3,29.37 v34.8,30.35
  Bottom 0.305: v21.21,38.23 NRF_SMD.CSN
  Bottom 0.406: R14.1 21.48,38.5 v21.21,38.23
RST  (via drill 0.33 pad 0.64)
  Top 0.254: 22.97,42.62 SW1.2 23.46,42.63 24.08,42.01 24.08,40.23 24.43,39.88 | 30.35,36.07 v30.48,35.94 28.07,38.35 v27.61,38.73 26.47,39.88 24.43,39.88 | 24.43,39.88 24.13,39.88 21.83,39.88 20.32,39.88 19.94,40.26 18.03,40.26 17.53,39.75 17.53,38.61 17.14,38.23 15.62,38.23 15.24,37.85 15.24,36.78 JP5.4
  Top 0.406: SW1.4 SW1.2
  Bottom 0.254: IC1.29 30.18,30.99 30.86,30.99 31.37,31.5 31.37,33.66 30.62,34.41 30.49,34.41 v30.48,35.94 30.47,34.41
  Bottom 0.406: R7.2 27.15,39.19 v27.61,38.73 27.8,38.55 C24.2
SCK  (via drill 0.33 pad 0.64)
  Top 0.254: v37.21,27.43 37.21,27.81 35.69,29.34 34.54,29.34 32.89,30.99 31.88,30.99 26.23,36.64 v25.33,36.64 24.76,36.7 23.75,36.7 22.99,35.94 21.46,35.94 20.83,36.58 20.83,36.96 v20.7,36.96 20.45,37.21 18.03,37.21 17.53,36.7 JP5.6
  Bottom 0.254: IC1.17 37.1,27.55 v37.21,27.43 | v25.33,36.64 IC2.6 25.27,36.2 25.4,36.07 | v20.7,36.96 20.45,36.7 18.9,36.7 NRF_SMD.SCK
VCC  (via drill 0.48)
  Top 0.406: 12.99,32.61 JP2.5 13.08,32.48 13.08,33.4 12.32,34.16 JP5.1 JP6.1 12.32,42.67 12.83,43.18 v17.27,43.18
  Bottom 0.254: IC2.7 26.54,35.31 26.42,35.18 25.53,35.18 25.15,34.8 25.15,32.51 25.27,32.38 IC2.3 25.27,29.84 arc-45 25.09,29.39 R4.2
  Bottom 0.406: IC1.4 34.05,36.61 C12.1 | 38.61,24.51 L1.1 38.48,22.26 | 35.69,34.64 IC1.6 35.65,35.65 36.83,36.58 37.7,36.58 C16.1 | v17.27,43.18 NRF_SMD.3V | 35.69,33.66 37.59,33.66 38.48,34.54 39.88,34.54 40.51,33.91 41.15,33.91 41.66,33.4 41.66,31.88 41.15,31.5 40.26,30.61 40.26,28.46 C11.1 | 40.64,27.57 C11.1 | IC2.8 IC2.7 26.49,37.56 R7.1 24.81,39.24 R14.2 | IC8.3 22.48,38.12 R14.2 | C11.1 40.66,27.15 R3.2 | 38.48,22.26 38.89,22.26 38.99,22.35 41.55,22.35 IC5.2 | 38.48,22.26 L3.2 | R14.2 23.61,39.34 21.79,41.15 C10.2
  Bottom 0.508: C12.1 34.31,37.59 R15.1 32.24,37.6 C7.1 30.61,39.81 30.61,40.89 30.75,41.03 | NRF_SMD.3V 21.61,42.04 C10.2 21.85,41.91 22.86,41.91 24.54,43.59 28.71,43.59 29.78,42.37 C9.1 29.83,41.95 30.75,41.03 | IC1.4 34.05,33.67 34.04,33.66 35.69,33.66 35.69,34.77 IC1.6 | 30.93,41.97 IC3.2 30.93,41.59 30.99,41.66 30.99,41.27 30.75,41.03 | 42.66,25.43 R3.2 42.66,24.09 IC5.2
VCC_ACS  (via drill 0.6, 0.6 pad 0.64)
  Top 0.406: v17.78,21.46 12.19,21.46 v11.18,22.86 | v22.86,22.86 22.86,22.35 22.35,21.84 20.57,21.08
  Top 0.508: 20.57,21.08 20.39,21.11 v17.78,21.46
  Bottom 0.406: L4.1 38.48,18.67 37.08,17.27 21.84,17.27 19.3,19.81 19.3,20.87 18.86,21.32 17.93,21.32 v17.78,21.46 | R5.2 23.42,23.16 23.29,23.29 | C1.1 11.57,22.36 arc45 11.5,22.54 v11.18,22.86
  Bottom 0.508: v17.78,21.46 17.78,22.71 IC6.5 | v11.18,22.86 10.16,22.86 | 10.16,22.86 10.08,22.86 | 23.29,23.29 v22.86,22.86 | IC4.8 10.11,22.91 10.16,22.86
  Bottom 0.61: C6.1 L4.1

### Text on the board
tPlace: RollersShutterNode r1.3a / (c) Scalz 2016 | FTDI | OpenHardware.io | AVRSPI | BUTTONS/I2C
bPlace: HIGH VOLTAGE SIDE. Be careful. Risk of death! | DOWN | UP | PWR | L_FUSE | L | N